# Altium schematic sheet Motors.SchDoc
size A
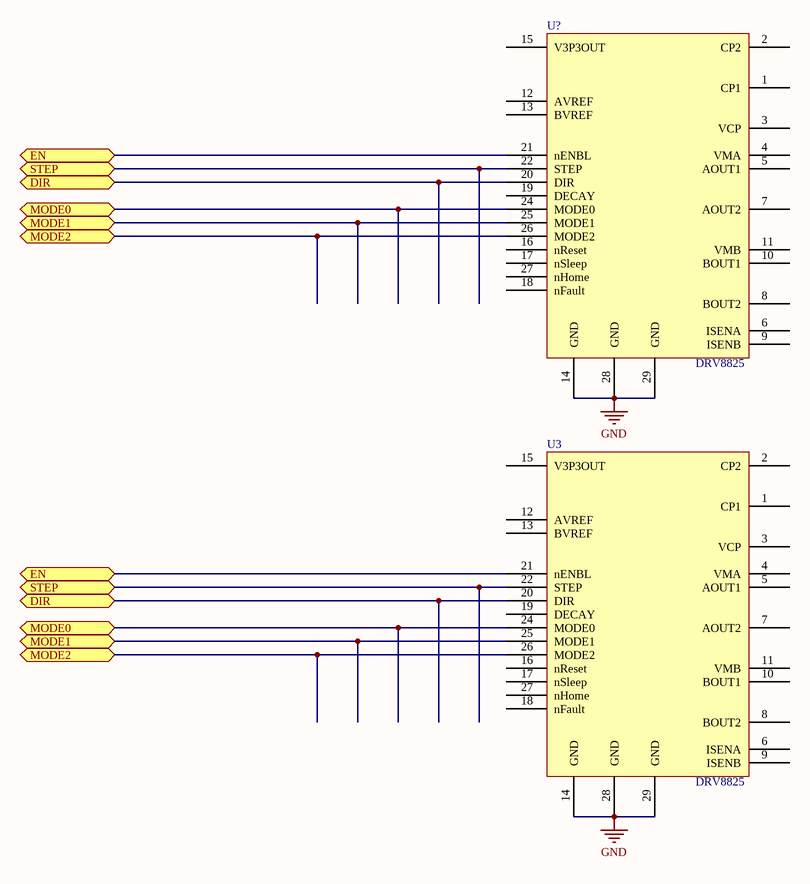
[diagram p0: Motors.SchDoc]

## Parts
U3  DRV8825  [DRV8825PWPR]
U?  DRV8825  [DRV8825PWPR]

## Ports
DIR, EN, MODE0, MODE1, MODE2, STEP

## Nets
GND: U3.14(GND) U3.28(GND) U3.29(GND) U?.14(GND) U?.28(GND) U?.29(GND)
DIR: U3.20(DIR) U?.20(DIR) ; port DIR
EN: U3.21(nENBL) U?.21(nENBL) ; port EN
MODE0: U3.24(MODE0) U?.24(MODE0) ; port MODE0
MODE1: U3.25(MODE1) U?.25(MODE1) ; port MODE1
MODE2: U3.26(MODE2) U?.26(MODE2) ; port MODE2
STEP: U3.22(STEP) U?.22(STEP) ; port STEP

Not connected (* = marked no-connect by the designer): U3 1(CP1) 2(CP2) 3(VCP) 4(VMA) 5(AOUT1) 6(ISENA) 7(AOUT2) 8(BOUT2) 9(ISENB) 10(BOUT1) 11(VMB) 12(AVREF) 13(BVREF) 15(V3P3OUT) 16(nReset) 17(nSleep) 18(nFault) 19(DECAY) 23(NC) 27(nHome); U? 1(CP1) 2(CP2) 3(VCP) 4(VMA) 5(AOUT1) 6(ISENA) 7(AOUT2) 8(BOUT2) 9(ISENB) 10(BOUT1) 11(VMB) 12(AVREF) 13(BVREF) 15(V3P3OUT) 16(nReset) 17(nSleep) 18(nFault) 19(DECAY) 23(NC) 27(nHome)

## Library data of the parts
U3 U? = DRV8825: DRV8825 Ti Stepper Driver; Manufacture: Texas Instruments; Mountining Type: SMD - Ti PowerPAD Package; Voltage: 8.2-45VDC; Cost (1000 qty): 2.25; Part Number: DRV8825PWPR; Status: In-Production; Pins: 28 Pins and one Exposed Pad; Datasheet: http://www.ti.com/lit/gpn/drv8825; Height: 1.2mm; Tolerance: N/A; Type: Stepper Driver - Integrated Circuit; Lead Free: YES